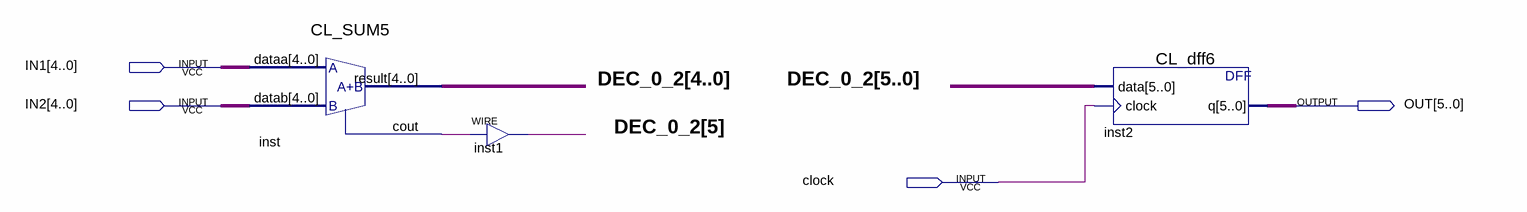
[diagram p0: schematic sheet]
// Quartus schematic CL_SUM5_BL.bdf as structural Verilog: 3 symbols, 4 pins
module CL_SUM5_BL (
  input  [4:0] IN1,
  input  [4:0] IN2,
  input  clock,
  output [5:0] OUT
);

  wire inst_cout;
  wire [5:0] DEC_0_2;

  CL_SUM5 inst (.dataa(IN1), .datab(IN2), .result(DEC_0_2[4:0]), .cout(inst_cout));
  assign DEC_0_2[5] = inst_cout;  // WIRE inst1
  CL_dff6 inst2 (.data(DEC_0_2), .clock(clock), .q(OUT));
endmodule
